# EAGLE design MegaAMP.Mk1 (EAGLE 6.5.0)
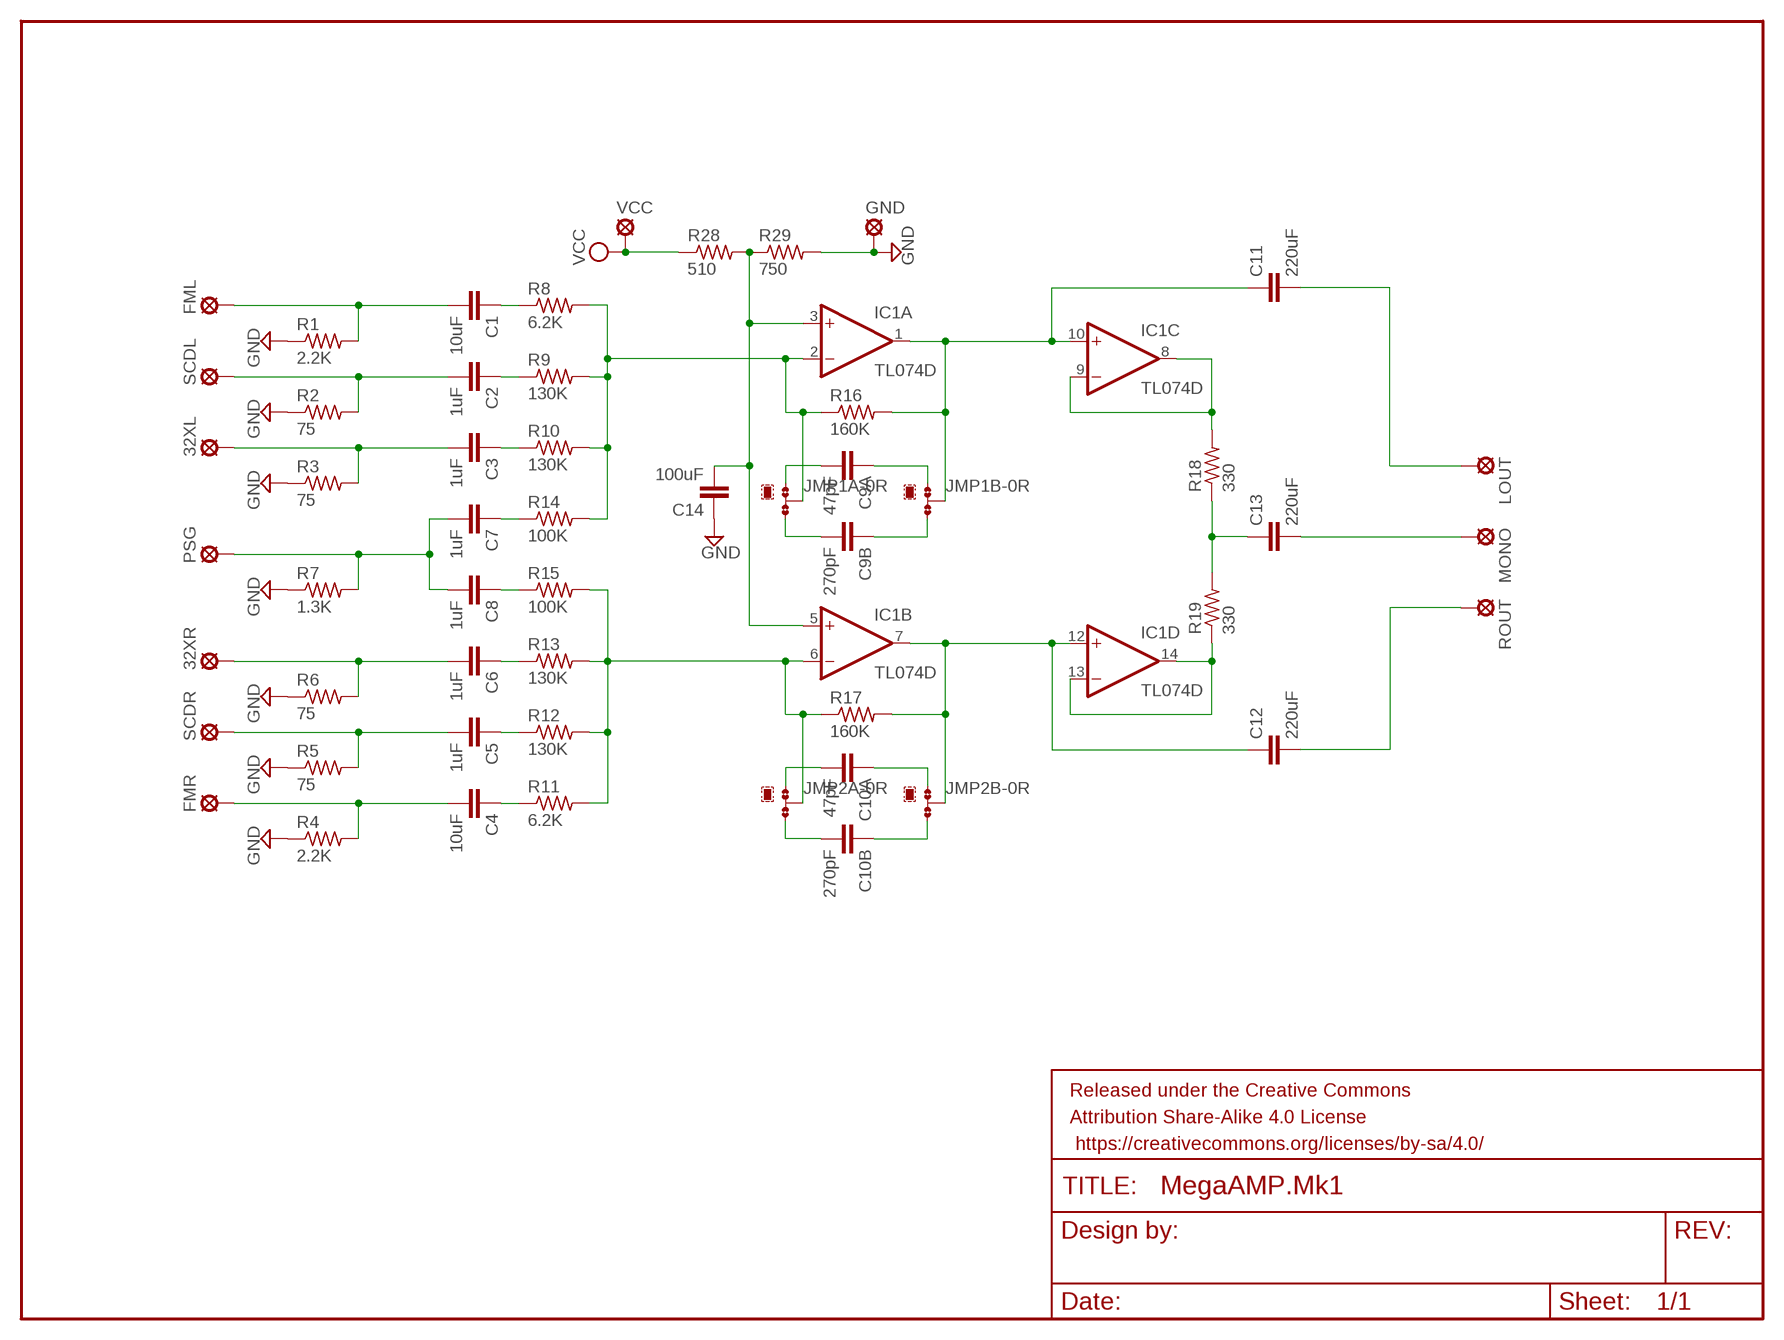
[diagram p0: schematic, sheet 1]

## Parts
32XL  LSP13  [LSP13]
32XR  LSP13  [LSP13]
C1  10uF  C-EUC0805  [C0805]
C2  1uF  C-EUC0805  [C0805]
C3  1uF  C-EUC0805  [C0805]
C4  10uF  C-EUC0805  [C0805]
C5  1uF  C-EUC0805  [C0805]
C6  1uF  C-EUC0805  [C0805]
C7  1uF  C-EUC0805  [C0805]
C8  1uF  C-EUC0805  [C0805]
C9A  47pF  C-EUC0805  [C0805]
C9B  270pF  C-EUC0805  [C0805]
C10A  47pF  C-EUC0805  [C0805]
C10B  270pF  C-EUC0805  [C0805]
C11  220uF  C-EUC1210  [C1210]
C12  220uF  C-EUC1210  [C1210]
C13  220uF  C-EUC1210  [C1210]
C14  100uF  C-EUC1206  [C1206]
FML  LSP13  [LSP13]
FMR  LSP13  [LSP13]
FRAME1  FRAME-LETTER  [CREATIVE_COMMONS]
GND  LSP13  [LSP13]
IC1  TL074D  [SO14]
JMP1A  0R-JUMPA  [A0R-JMP]
JMP1B  0R-JUMPA  [A0R-JMP]
JMP2A  0R-JUMPA  [A0R-JMP]
JMP2B  0R-JUMPA  [A0R-JMP]
LOUT  LSP13  [LSP13]
MONO  LSP13  [LSP13]
PSG  LSP13  [LSP13]
R1  2.2K  R-US_R0805  [R0805]
R2  75  R-US_R0805  [R0805]
R3  75  R-US_R0805  [R0805]
R4  2.2K  R-US_R0805  [R0805]
R5  75  R-US_R0805  [R0805]
R6  75  R-US_R0805  [R0805]
R7  1.3K  R-US_R0805  [R0805]
R8  6.2K  R-US_R0805  [R0805]
R9  130K  R-US_R0805  [R0805]
R10  130K  R-US_R0805  [R0805]
R11  6.2K  R-US_R0805  [R0805]
R12  130K  R-US_R0805  [R0805]
R13  130K  R-US_R0805  [R0805]
R14  100K  R-US_R0805  [R0805]
R15  100K  R-US_R0805  [R0805]
R16  160K  R-US_R0805  [R0805]
R17  160K  R-US_R0805  [R0805]
R18  330  R-US_R0805  [R0805]
R19  330  R-US_R0805  [R0805]
R28  510  R-US_R0805  [R0805]
R29  750  R-US_R0805  [R0805]
ROUT  LSP13  [LSP13]
SCDL  LSP13  [LSP13]
SCDR  LSP13  [LSP13]
VCC  LSP13  [LSP13]

## Nets
GND: C14.1 GND.MP R1.1 R2.1 R3.1 R4.1 R5.1 R6.1 R7.1 R29.2
N$1: C11.1 IC1.1(A:OUT) IC1.10(C:+IN) JMP1B.2 R16.2
N$2: C13.1 R18.1 R19.2
N$3: R28.1 VCC.MP ; supply symbol labelled VCC
N$4: C12.2 ROUT.MP
N$5: C14.2 IC1.3(A:+IN) IC1.5(B:+IN) R28.2 R29.1
N$7: IC1.8(C:OUT) IC1.9(C:-IN) R18.2
N$8: C9A.2 JMP1A.1
N$9: IC1.13(D:-IN) IC1.14(D:OUT) R19.1
N$10: C9A.1 JMP1B.1
N$11: C9B.2 JMP1A.3
N$12: C9B.1 JMP1B.3
N$13: C12.1 IC1.7(B:OUT) IC1.12(D:+IN) JMP2B.2 R17.2
N$15: C10A.2 JMP2A.1
N$16: C10A.1 JMP2B.1
N$17: C10B.2 JMP2A.3
N$18: C10B.1 JMP2B.3
N$20: C11.2 LOUT.MP
N$21: C13.2 MONO.MP
N$22: C1.2 FML.MP R1.2
N$23: C2.2 R2.2 SCDL.MP
N$24: 32XL.MP C3.2 R3.2
N$25: C7.2 C8.2 PSG.MP R7.2
N$26: 32XR.MP C6.2 R6.2
N$27: C5.2 R5.2 SCDR.MP
N$28: C4.2 FMR.MP R4.2
N$29: C1.1 R8.1
N$30: C2.1 R9.1
N$31: C3.1 R10.1
N$32: C7.1 R14.1
N$33: C8.1 R15.1
N$34: C6.1 R13.1
N$35: C5.1 R12.1
N$36: C4.1 R11.1
N$37: IC1.2(A:-IN) JMP1A.2 R8.2 R9.2 R10.2 R14.2 R16.1
N$38: IC1.6(B:-IN) JMP2A.2 R11.2 R12.2 R13.2 R15.2 R17.1

## Power pins joined to a net without a drawn wire
V+: IC1.4(P:V+)
V-: IC1.11(P:V-)

## Library data of the parts
32XL 32XR FML FMR GND LOUT MONO PSG ROUT SCDL SCDR VCC = solpad:LSP13: SOLDER PAD drill 1.3 mm, distributor Buerklin, 12H562
C1-C8 C9A C9B C10A C10B = rcl:C-EU: CAPACITOR, European symbol
C11-C14 = resistor:C-EU: CAPACITOR, European symbol
FRAME1 = SparkFun-Aesthetics:FRAME-LETTER: Schematic Frame Standard 8.5x11 US Letter frame
IC1 = linear:TL074: OP AMP
JMP1A JMP1B JMP2A JMP2B = jump-0r-smd:0R-JUMP: SMD 0R 0805 Jumper
R1-R19 R28 R29 = resistor:R-US_: RESISTOR, American symbol

## Board
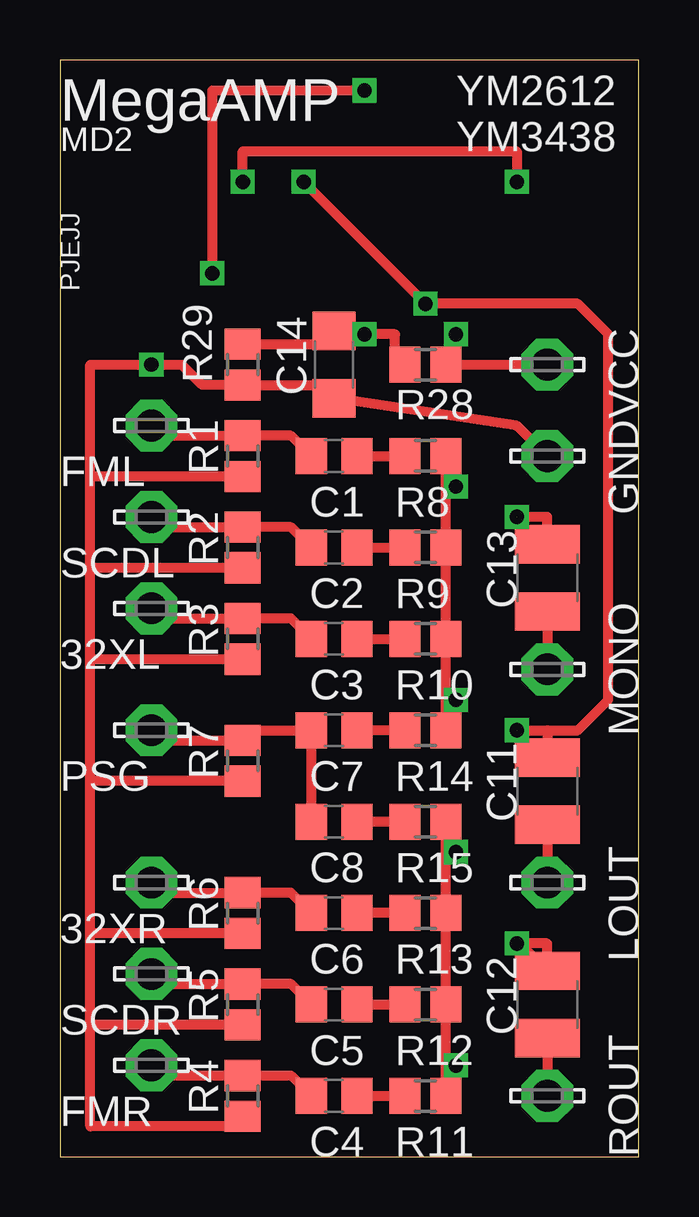
[diagram p1: board, top side]
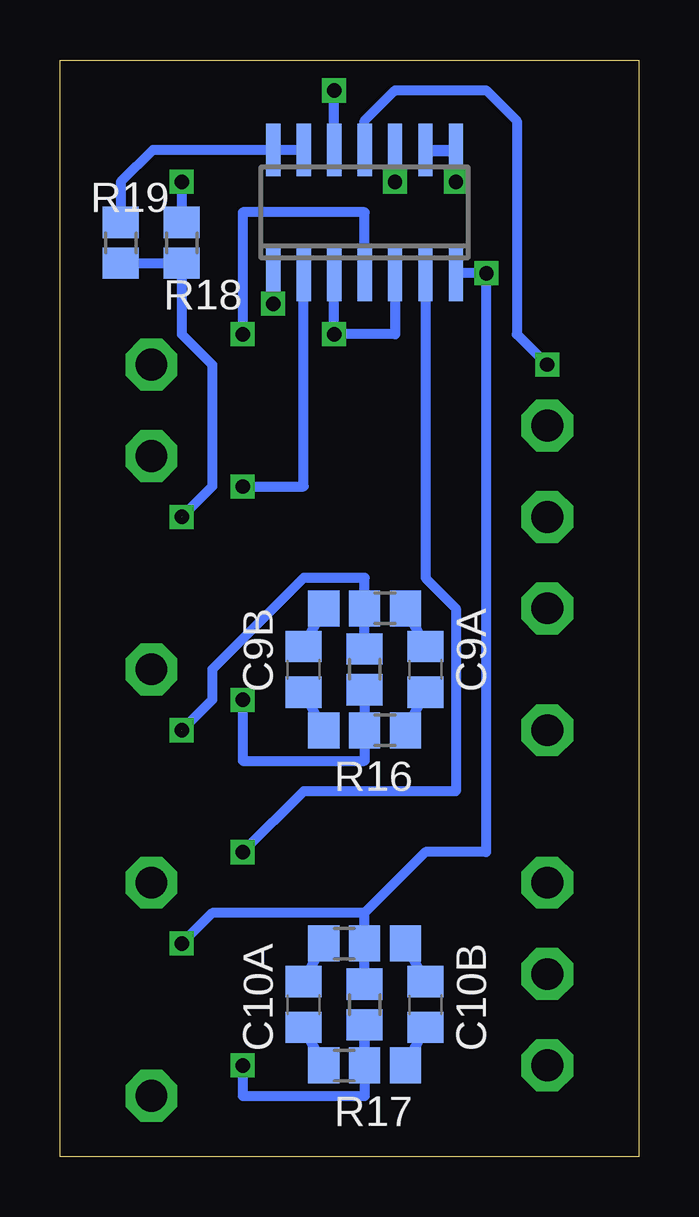
[diagram p2: board, bottom side, seen from below]

Size 24.13 x 45.72 mm. Coordinates in mm from the lower left corner, seen from the top.
Outline: 0,0 24.13,0 24.13,45.72 0,45.72 0,0
Copper layers (1*16): Top 0.035mm / dielectric 1.5mm / Bottom 0.035mm
Design rules "default": minimum track width 10mil, minimum drill 0.6mm, track to track 8mil, track to pad 8mil, pad to pad 8mil, via to via 8mil, smd to smd 8mil, copper to edge 40mil, drill to drill 8mil, minimum pad ring 10mil, minimum via ring 8mil, stop-mask expansion 4mil, vias tented up to drill 0mil, thermal gap 10mil

### Footprints (pad centres in the part's own frame; a part is rotated, then mirrored left to right if it is on the bottom)
LSP13 = drill 1.321 pad 2.159 octagon: MP 0,0
C0805 = smd 1.3 x 1.5: 1 -0.95,0; 2 0.95,0
C1210 = smd 1.6 x 2.7: 1 -1.4,0; 2 1.4,0
C1206 = smd 1.6 x 1.8: 1 -1.4,0; 2 1.4,0
SO14 = smd 0.6 x 2.2: 1 -3.81,-2.6; 2 -2.54,-2.6; 3 -1.27,-2.6; 4 0,-2.6; 5 1.27,-2.6; 6 2.54,-2.6; 7 3.81,-2.6; 8 3.81,2.6; 9 2.54,2.6; 10 1.27,2.6; 11 0,2.6; 12 -1.27,2.6; 13 -2.54,2.6; 14 -3.81,2.6
A0R-JMP = smd 1.5 x 1.3: 1 0,1.7; 2 0,0; 3 0,-1.7
R0805 = smd 1.3 x 1.5: 1 -0.85,0; 2 0.85,0

### Placement (x,y rotation side)
32XL  3.81,22.86 0 top
32XR  3.81,11.43 0 top
C1  11.43,29.21 180 top
C2  11.43,25.4 180 top
C3  11.43,21.59 180 top
C4  11.43,2.54 180 top
C5  11.43,6.35 180 top
C6  11.43,10.16 180 top
C7  11.43,17.78 180 top
C8  11.43,13.97 180 top
C9A  8.89,20.32 270 bottom
C9B  13.97,20.32 270 bottom
C10A  13.97,6.35 270 bottom
C10B  8.89,6.35 270 bottom
C11  20.32,15.24 270 top
C12  20.32,6.35 270 top
C13  20.32,24.13 270 top
C14  11.43,33.02 90 top
FML  3.81,30.48 0 top
FMR  3.81,3.81 0 top
FRAME1  20.32,-8.89 0 top  (outside the outline)
GND  20.32,29.21 180 top
IC1  11.43,39.37 0 bottom
JMP1A  11.43,17.78 270 bottom
JMP1B  11.43,22.86 270 bottom
JMP2A  11.43,3.81 90 bottom
JMP2B  11.43,8.89 90 bottom
LOUT  20.32,11.43 180 top
MONO  20.32,20.32 180 top
PSG  3.81,17.78 0 top
R1  7.62,29.21 90 top
R2  7.62,25.4 90 top
R3  7.62,21.59 90 top
R4  7.62,2.54 90 top
R5  7.62,6.35 90 top
R6  7.62,10.16 90 top
R7  7.62,16.51 90 top
R8  15.24,29.21 0 top
R9  15.24,25.4 0 top
R10  15.24,21.59 0 top
R11  15.24,2.54 0 top
R12  15.24,6.35 0 top
R13  15.24,10.16 0 top
R14  15.24,17.78 0 top
R15  15.24,13.97 0 top
R16  11.43,20.32 90 bottom
R17  11.43,6.35 90 bottom
R18  19.05,38.1 90 bottom
R19  21.59,38.1 270 bottom
R28  15.24,33.02 180 top
R29  7.62,33.02 270 top
ROUT  20.32,2.54 180 top
SCDL  3.81,26.67 0 top
SCDR  3.81,7.62 0 top
VCC  20.32,33.02 180 top

### Tracks (layer width: path | path; a pad name or v marks a point on that pad's centre or on a via)
GND  (via drill 0.6)
  Top 0.406: R4.1 7.62,1.27 1.27,1.27 1.27,5.5 | 1.27,5.5 1.27,9.31 | 1.27,9.31 1.27,15.66 | 1.27,15.66 1.27,20.74 | 1.27,20.74 1.27,24.55 | 1.27,24.55 1.27,28.36 | 1.27,28.36 1.27,33.02 v3.81,33.02 5.08,33.02 5.93,32.17 R29.2 11.43,32.17 C14.1 19.05,30.48 GND.MP | R5.1 1.27,5.5 | R6.1 1.27,9.31 | R7.1 1.27,15.66 | R3.1 1.27,20.74 | R2.1 1.27,24.55 | R1.1 1.27,28.36
  Bottom 0.406: 11.43,41.91 11.43,43.18 10.16,44.45 6.35,44.45 5.08,43.18 5.08,34.29 v3.81,33.02
N$1  (via drill 0.6)  (1 unrouted)
  Top 0.406: 19.05,17.78 20.32,17.78 | 20.32,17.78 C11.1 | 20.32,17.78 21.59,17.78 22.86,19.05 22.86,34.29 21.59,35.56 v15.24,35.56 v10.16,40.64
  Bottom 0.406: IC1.10 v10.16,40.64 | v15.24,35.56 IC1.1 15.24,36.83 | R16.2 JMP1B.2 11.43,24.13 13.97,24.13 17.78,20.32 17.78,19.05 19.05,17.78
N$2  (1 unrouted)
  Top 0.406: C13.1 20.32,26.67 19.05,26.67
  Bottom 0.406: R19.2 R18.1 19.05,34.29 17.78,33.02 17.78,27.94 19.05,26.67
N$3  (via drill 0.6)
  Top 0.406: R28.1 16.51,33.02 | 16.51,33.02 VCC.MP | v16.51,34.29 16.51,33.02
  Bottom 0.406: 11.43,36.83 11.43,39.37 16.51,39.37 v16.51,34.29
N$4
  Top 0.406: C12.2 ROUT.MP
N$5  (via drill 0.6)
  Top 0.406: R29.1 11.43,33.87 C14.2 | R28.2 13.97,33.02 13.97,34.29 v12.7,34.29 | v12.7,34.29 11.43,34.29 C14.2 | C14.2 v12.7,34.29
  Bottom 0.406: IC1.5 10.16,34.29 v12.7,34.29 IC1.3
N$7  (via drill 0.6)
  Top 0.406: v7.62,40.64 7.62,41.91 19.05,41.91 v19.05,40.64
  Bottom 0.406: IC1.8 IC1.9 8.89,41.91 7.62,41.91 v7.62,40.64 | v19.05,40.64 R18.2
N$8
  Bottom 0.406: C9A.2 JMP1A.1
N$9
  Bottom 0.406: IC1.13 IC1.14 20.26,41.97 21.59,40.64 R19.1
N$10
  Bottom 0.406: JMP1B.1 C9A.1
N$11
  Bottom 0.406: C9B.2 JMP1A.3
N$12
  Bottom 0.406: JMP1B.3 C9B.1
N$13  (via drill 0.6)
  Top 0.406: v6.35,36.83 6.35,44.45 v12.7,44.45 | C12.1 20.32,8.89 v19.05,8.89 19.18,8.89 C12.1
  Bottom 0.406: IC1.12 v12.7,44.45 | IC1.7 7.62,36.83 v6.35,36.83 6.35,12.7 8.89,12.7 11.43,10.16 | R17.2 JMP2B.2 11.43,10.16 | 11.43,10.16 17.78,10.16 v19.05,8.89
N$14  (via drill 0.6)
  other vias: 16.51,27.94
N$15
  Bottom 0.406: JMP2A.1 C10A.2
N$16
  Bottom 0.406: C10A.1 JMP2B.1
N$17
  Bottom 0.406: C10B.2 JMP2A.3
N$18
  Bottom 0.406: C10B.1 JMP2B.3
N$19  (via drill 0.6)
  other vias: 16.51,19.05
N$20
  Top 0.406: C11.2 LOUT.MP
N$21
  Top 0.406: C13.2 MONO.MP
N$22
  Top 0.406: FML.MP 4.23,30.06 R1.2 9.63,30.06 C1.2
N$23
  Top 0.406: SCDL.MP 4.23,26.25 R2.2 9.63,26.25 C2.2
N$24
  Top 0.406: 32XL.MP 4.23,22.44 R3.2 9.63,22.44 C3.2
N$25
  Top 0.406: C8.2 C7.2 8.04,17.78 R7.2 4.23,17.36 PSG.MP
N$26
  Top 0.406: C6.2 9.63,11.01 R6.2 4.23,11.01 32XR.MP
N$27
  Top 0.406: R5.2 7.62,7.62 | C5.2 9.63,7.2 R5.2 | SCDR.MP 4.23,7.2 R5.2
N$28
  Top 0.406: 7.2,3.81 R4.2 | R4.2 9.63,3.39 C4.2 | FMR.MP 4.23,3.39 R4.2
N$29
  Top 0.406: C1.1 R8.1
N$30
  Top 0.406: C2.1 R9.1
N$31
  Top 0.406: C3.1 R10.1
N$32
  Top 0.406: R14.1 C7.1
N$33
  Top 0.406: R15.1 C8.1
N$34
  Top 0.406: R13.1 C6.1
N$35
  Top 0.406: C5.1 R12.1
N$36
  Top 0.406: C4.1 R11.1
N$37  (via drill 0.6)
  Top 0.406: v16.51,27.94 16.51,29.21 R8.2 R9.2 R10.2 R14.2 16.51,17.78 v16.51,19.05
  Bottom 0.406: R16.1 JMP1A.2 11.43,16.51 16.51,16.51 v16.51,19.05 | v16.51,27.94 13.97,27.94 IC1.2
N$38  (via drill 0.6)
  Top 0.406: R15.2 R13.2 R12.2 R11.2 16.09,3.81 v16.51,3.81 | R15.2 16.09,12.7 v16.51,12.7 16.51,13.55 R15.2
  Bottom 0.406: JMP2A.2 R17.1 11.43,2.54 16.51,2.54 v16.51,3.81 | 8.89,36.83 IC1.6 8.89,24.13 7.62,22.86 7.62,15.24 13.97,15.24 v16.51,12.7
N$39  (via drill 0.6)
  other vias: 19.05,17.78
N$40  (via drill 0.6)
  other vias: 19.05,8.89
N$41  (via drill 0.6)
  other vias: 19.05,26.67
N$42  (via drill 0.6)
  other vias: 16.51,12.7
N$43  (via drill 0.6)
  other vias: 16.51,3.81
N$44  (via drill 0.6)
  other vias: 7.62,40.64
N$45  (via drill 0.6)
  other vias: 19.05,40.64

### Text on the board
tNames: MegaAMP | MD2 | YM2612 / YM3438 | PJEJJ